# Altium project tx.PrjPcb
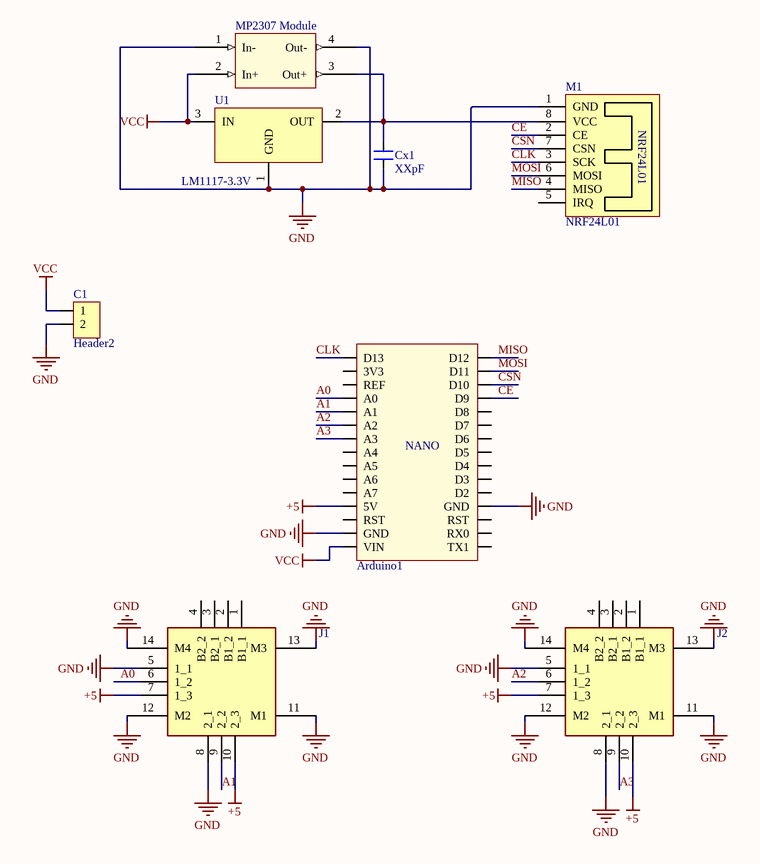
[diagram p0: tx.SchDoc]
1 sheet, 8 parts. Net scope: global (net labels, ports and power ports of the same name join across sheets).
Board files: PCB1.PcbDoc, V2.PcbDoc

## Sheet tx.SchDoc
size A4

### Parts
Arduino1  Arduino Nano  [Arduino Nano]  (value not drawn)
C1  Header2  [Header2]
Cx1  XXpF  [CN-SMD-1206]
J1  RKJXV1224005  [RKJXV1224005]  (value not drawn)
J2  RKJXV1224005  [RKJXV1224005]  (value not drawn)
M1  NRF24L01  [NRF24L01]
MP2307_Module  MP2307 DC-DC Switching Buck Step-Down Module  [Mini360]  (value not drawn)
U1  LM1117-3.3V  [SOT223]

### Nets
+5: Arduino1.5V J1.7(1_3) J1.10(2_3) J2.7(1_3) J2.10(2_3)
GND: Arduino1.GND C1.2 Cx1.1 J1.5(1_1) J1.8(2_1) J1.11(M1) J1.12(M2) J1.13(M3) J1.14(M4) J2.5(1_1) J2.8(2_1) J2.11(M1) J2.12(M2) J2.13(M3) J2.14(M4) M1.1(GND) MP2307_Module.1(In-) MP2307_Module.4(Out-) U1.1(GND)
VCC: Arduino1.VIN C1.1 MP2307_Module.2(In+) U1.3(IN)
A0: Arduino1.A0 J1.6(1_2)
A1: Arduino1.A1 J1.9(2_2)
A2: Arduino1.A2 J2.6(1_2)
A3: Arduino1.A3 J2.9(2_2)
CE: Arduino1.D9 M1.2(CE)
CLK: Arduino1.D13 M1.3(SCK)
CSN: Arduino1.D10 M1.7(CSN)
MISO: Arduino1.D12 M1.4(MISO)
MOSI: Arduino1.D11 M1.6(MOSI)
NetCx1_2: Cx1.2 M1.8(VCC) MP2307_Module.3(Out+) U1.2(OUT)

Not connected (* = marked no-connect by the designer): Arduino1 3V3 A4 A5 A6 A7 D2 D3 D4 D5 D6 D7 D8 REF RST RX0 TX1; J1 1(B1_1) 2(B1_2) 3(B2_1) 4(B2_2); J2 1(B1_1) 2(B1_2) 3(B2_1) 4(B2_2); M1 5(IRQ)

### Notes on the sheet
- (in symbol Arduino Nano) NANO

### Library data of the parts
Arduino1 = Arduino Nano: Value: Cau 1A
C1 = Header2: Header IDC, 2 x 1 Pin Vertical 2.54mm Pitch (Non-Boxed, Male); Manufacturer: W¨¹rth Elektronik eiSos GmbH; partNo: 613002143121; ComponentLink1 Description: Manufacturer; ComponentLink2 Description: Datasheet; NoPins: 02; Created Date: 29 March 2013; ComponentLink1URL: http://www.we-online.com; ComponentLink2URL: http://katalog.we-online.de/em/datasheet/6130xx143121.pdf; Created by: Karrer Zheng
Cx1 = CN: Value: 33pF
J1 J2 = RKJXV1224005: Joystick; Manufacturer_Name: ALPS; Datasheet Link: http://www.alps.com/prod/info/E/HTML/MultiControl/Potentiometer/RKJXK/RKJXV1224005.html; Manufacturer_Part_Number: RKJXV1224005; Mouser Part Number: 688-RKJXV1224005; Mouser Price/Stock: https://www.mouser.com/Search/Refine.aspx?Keyword=688-RKJXV1224005; RS Part Number: 1239578; RS Price/Stock: http://uk.rs-online.com/web/p/products/1239578
MP2307_Module = MP2307 Module
U1 = LM1117: 800mA Low-Dropout Linear Regulator; Creator: Nguyen Ba Bien; Website: http://group3i.net